# EAGLE design NIRGM V3 E7 (EAGLE 7.7.0)

## Sheet 1 of 7: Voltage Regulator
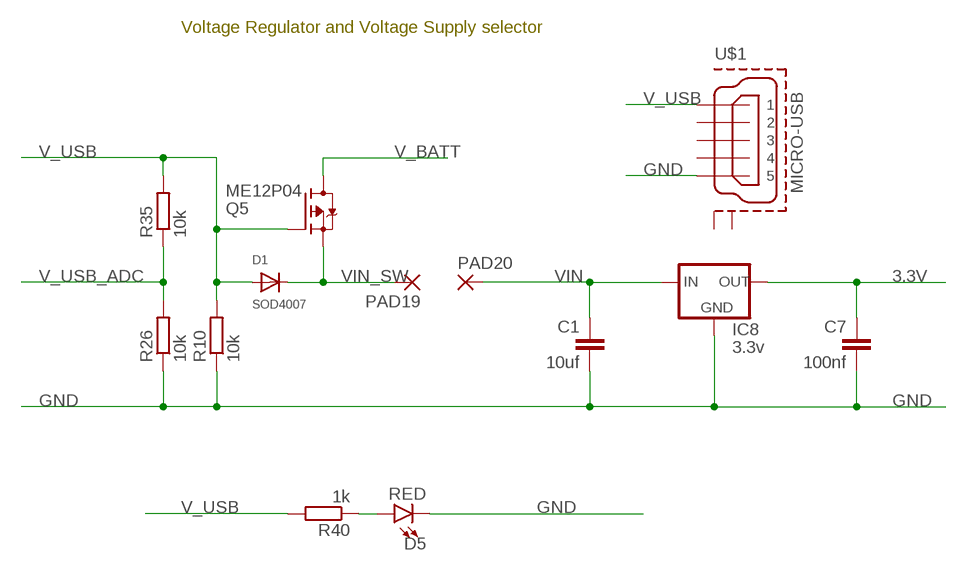
[diagram p0: schematic, sheet 1]

### Parts
C1  10uf  C-EUC1206K  [C1206K]
C7  100nf  C-EUC1206K  [C1206K]
D1  SOD4007  DIODE_SOD-123FL  [SOD-123FL]
D5  RED  LED-GREEN1206  [LED-1206]
IC8  3.3v  LM1117TO252  [TO252]
PAD19  SMD2  [SMD1,27-2,54]
PAD20  SMD2  [SMD1,27-2,54]
Q5  ME12P04  FDD4141TO252  [TO252]
R10  10k  R-EU_R1206  [R1206]
R26  10k  R-EU_R1206  [R1206]
R35  10k  R-EU_R1206  [R1206]
R40  1k  R-EU_R1206  [R1206]
U$1  MICRO-USB  MICRO-USB-RECEPTACLE47589-0001  [47589-0001]

### Nets
3.3V: C7.1 IC8.3(OUT) ; also sheet 3,4,5,6,7
GND: C1.2 C7.2 D5.C IC8.1(GND) R10.1 R26.1 U$1.5 ; also sheet 2,3,4,5,6,7
N$1: D5.A R40.1
V_BATT: Q5.3(D) ; also sheet 2,7
V_USB: D1.A Q5.1(G) R10.2 R35.2 R40.2 U$1.1 ; also sheet 2
V_USB_ADC: R26.2 R35.1 ; also sheet 5
VIN: C1.1 IC8.2(IN) PAD20.1(P)
VIN_SW: D1.C PAD19.1(P) Q5.2(S)
Unconnected: U$1.2 U$1.3 U$1.4 U$1.P$1(GND1) U$1.P$2(GND2)

### Notes on the sheet
- Voltage Regulator and Voltage Supply selector

## Sheet 2 of 7: Lithium-Polymer Battery Charger (1-cell)
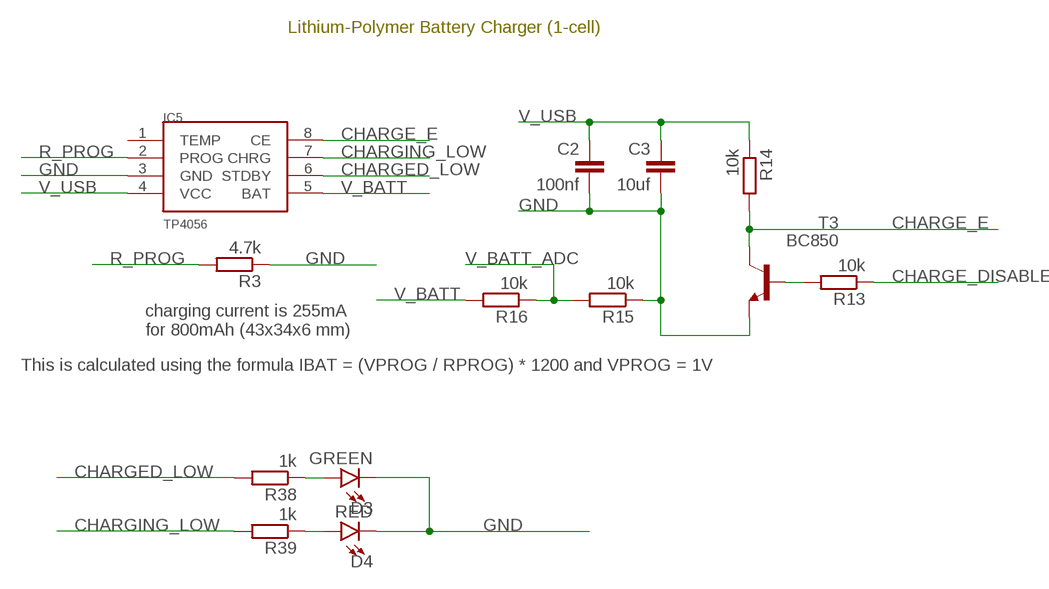
[diagram p1: schematic, sheet 2]

### Parts
C2  100nf  C-EUC1206K  [C1206K]
C3  10uf  C-EUC1206K  [C1206K]
D3  GREEN  LED-GREEN1206  [LED-1206]
D4  RED  LED-GREEN1206  [LED-1206]
IC5  TP4056  [SOP-8]
R3  4.7k  R-EU_R1206  [R1206]
R13  10k  R-EU_R1206  [R1206]
R14  10k  R-EU_R1206  [R1206]
R15  10k  R-EU_R1206  [R1206]
R16  10k  R-EU_R1206  [R1206]
R38  1k  R-EU_R1206  [R1206]
R39  1k  R-EU_R1206  [R1206]
T3  BC850  [SOT23]

### Nets
CHARGE_DISABLE: R13.1 ; also sheet 5
CHARGE_E: IC5.8(CE) R14.2 T3.3(C)
CHARGED_LOW: IC5.6(STDBY) R38.2 ; also sheet 5
CHARGING_LOW: IC5.7(CHRG) R39.2 ; also sheet 5
GND: C2.2 C3.2 D3.C D4.C IC5.3(GND) R3.1 R15.1 T3.2(E) ; also sheet 1,3,4,5,6,7
N$4: D3.A R38.1
N$6: D4.A R39.1
N$13: R13.2 T3.1(B)
R_PROG: IC5.2(PROG) R3.2
V_BATT: IC5.5(BAT) R16.2 ; also sheet 1,7
V_BATT_ADC: R15.2 R16.1 ; also sheet 5
V_USB: C2.1 C3.1 IC5.4(VCC) R14.1 ; also sheet 1
Unconnected: IC5.1(TEMP)

### Notes on the sheet
- Lithium-Polymer Battery Charger (1-cell)
- charging current is 255mA
  for 800mAh (43x34x6 mm)
- This is calculated using the formula IBAT = (VPROG / RPROG) * 1200 and VPROG = 1V

## Sheet 3 of 7: Negative Voltage Generator
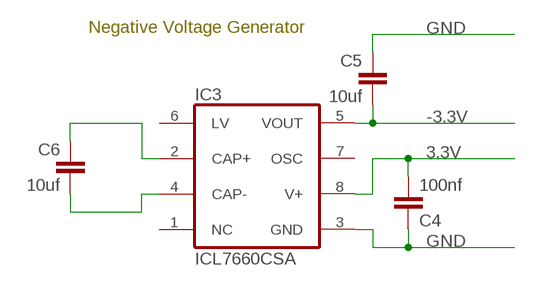
[diagram p2: schematic, sheet 3]

### Parts
C4  100nf  C-EUC1206K  [C1206K]
C5  10uf  C-EUC1206K  [C1206K]
C6  10uf  C-EUC1206K  [C1206K]
IC3  ICL7660CSA  [SO08]

### Nets
3.3V: C4.2 IC3.8(V+) ; also sheet 1,4,5,6,7
-3.3V: C5.2 IC3.5(VOUT) ; also sheet 6
GND: C4.1 C5.1 IC3.3(GND) ; also sheet 1,2,4,5,6,7
N$10: C6.1 IC3.2(CAP+)
N$16: C6.2 IC3.4(CAP-)
Unconnected: IC3.1(NC) IC3.6(LV) IC3.7(OSC)

### Notes on the sheet
- Negative Voltage Generator

## Sheet 4 of 7: LED Driver
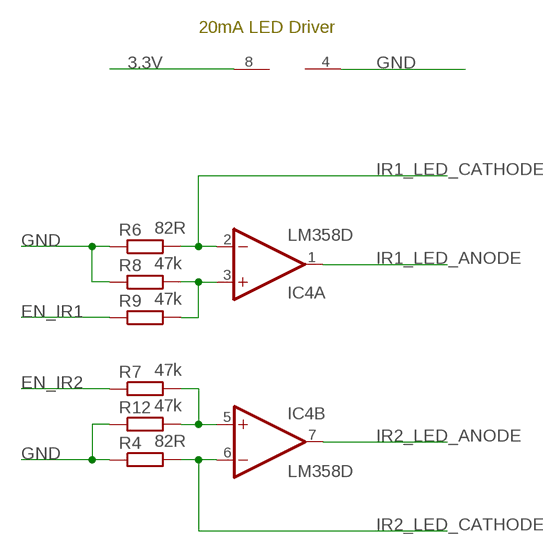
[diagram p3: schematic, sheet 4]

### Parts
IC4  LM358D  [SO08]
R4  82R  R-EU_R1206  [R1206]
R6  82R  R-EU_R1206  [R1206]
R7  47k  R-EU_R1206  [R1206]
R8  47k  R-EU_R1206  [R1206]
R9  47k  R-EU_R1206  [R1206]
R12  47k  R-EU_R1206  [R1206]

### Nets
3.3V: IC4.8(P:V+) ; also sheet 1,3,5,6,7
EN_IR1: R9.1 ; also sheet 5
EN_IR2: R7.1 ; also sheet 5
GND: IC4.4(P:V-) R4.1 R6.1 R8.1 R12.1 ; also sheet 1,2,3,5,6,7
IR1_LED_ANODE: IC4.1(A:OUT) ; also sheet 7
IR1_LED_CATHODE: IC4.2(A:-IN) R6.2 ; also sheet 7
IR2_LED_ANODE: IC4.7(B:OUT) ; also sheet 7
IR2_LED_CATHODE: IC4.6(B:-IN) R4.2 ; also sheet 7
N$30: IC4.3(A:+IN) R8.2 R9.2
N$31: IC4.5(B:+IN) R7.2 R12.2

### Notes on the sheet
- 20mA LED Driver

## Sheet 5 of 7: ESP32
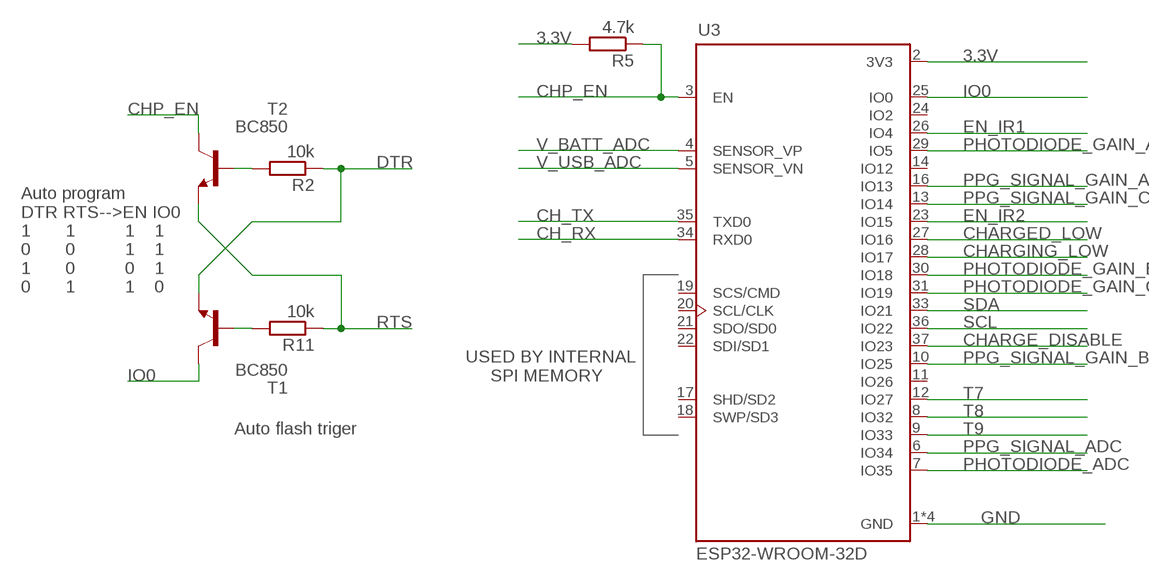
[diagram p4: schematic, sheet 5]

### Parts
R2  10k  R-EU_R1206  [R1206]
R5  4.7k  R-EU_R1206  [R1206]
R11  10k  R-EU_R1206  [R1206]
T1  BC850  [SOT23]
T2  BC850  [SOT23]
U3  ESP32-WROOM-32D  [MODULE_ESP32-WROOM-32D]

### Nets
3.3V: R5.2 U3.2(3V3) ; also sheet 1,3,4,6,7
CH_RX: U3.34(RXD0) ; also sheet 7
CH_TX: U3.35(TXD0) ; also sheet 7
CHARGE_DISABLE: U3.37(IO23) ; also sheet 2
CHARGED_LOW: U3.27(IO16) ; also sheet 2
CHARGING_LOW: U3.28(IO17) ; also sheet 2
CHP_EN: R5.1 T2.3(C) U3.3(EN)
DTR: R2.1 T1.2(E) ; also sheet 7
EN_IR1: U3.26(IO4) ; also sheet 4
EN_IR2: U3.23(IO15) ; also sheet 4
GND: U3.1(GND) U3.15(GND) U3.38(GND) U3.39(GND) ; also sheet 1,2,3,4,6,7
IO0: T1.3(C) U3.25(IO0)
N$5: R11.2 T1.1(B)
N$18: R2.2 T2.1(B)
PHOTODIODE_ADC: U3.7(IO35) ; also sheet 6
PHOTODIODE_GAIN_A: U3.29(IO5) ; also sheet 6
PHOTODIODE_GAIN_B: U3.30(IO18) ; also sheet 6
PHOTODIODE_GAIN_C: U3.31(IO19) ; also sheet 6
PPG_SIGNAL_ADC: U3.6(IO34) ; also sheet 6
PPG_SIGNAL_GAIN_A: U3.16(IO13) ; also sheet 6
PPG_SIGNAL_GAIN_B: U3.10(IO25) ; also sheet 6
PPG_SIGNAL_GAIN_C: U3.13(IO14) ; also sheet 6
RTS: R11.1 T2.2(E) ; also sheet 7
SCL: U3.36(IO22) ; also sheet 7
SDA: U3.33(IO21) ; also sheet 7
T7: U3.12(IO27) ; also sheet 7
T8: U3.8(IO32) ; also sheet 7
T9: U3.9(IO33) ; also sheet 7
V_BATT_ADC: U3.4(SENSOR_VP) ; also sheet 2
V_USB_ADC: U3.5(SENSOR_VN) ; also sheet 1
Unconnected: U3.11(IO26) U3.14(IO12) U3.17(SHD/SD2) U3.18(SWP/SD3) U3.19(SCS/CMD) U3.20(SCL/CLK) U3.21(SDO/SD0) U3.22(SDI/SD1) U3.24(IO2)

### Notes on the sheet
- Auto program
  DTR RTS-->EN IO0 
  1       1          1    1
  0       0          1    1
  1       0          0    1
  0       1          1    0
- USED BY INTERNAL
       SPI MEMORY
- Auto flash triger

## Sheet 6 of 7: Programable gain amplifier
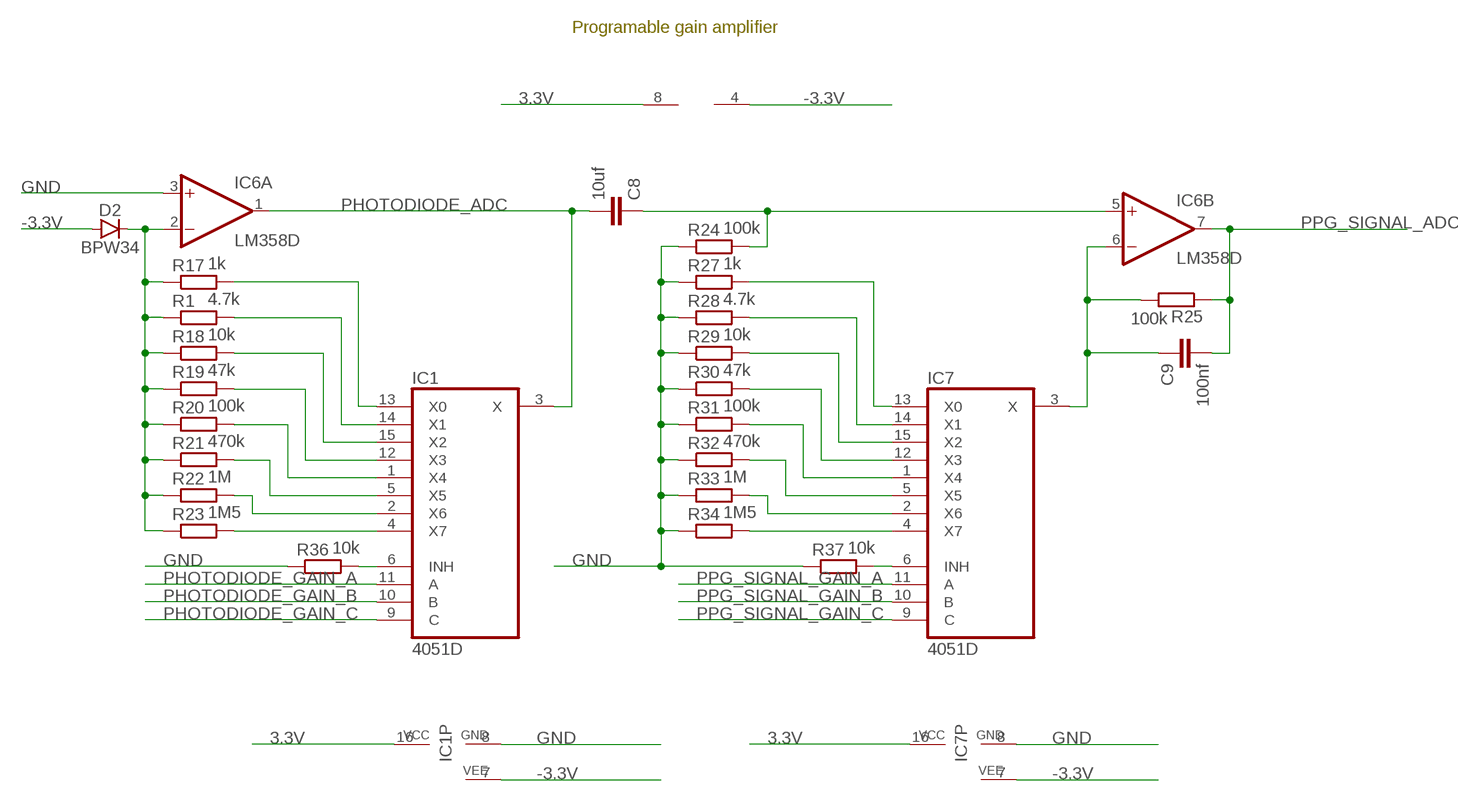
[diagram p5: schematic, sheet 6]

### Parts
C8  10uf  C-EUC1206K  [C1206K]
C9  100nf  C-EUC1206K  [C1206K]
D2  BPW34  [BPW34]
IC1  4051D  [SO16]
IC6  LM358D  [SO08]
IC7  4051D  [SO16]
R1  4.7k  R-EU_R1206  [R1206]
R17  1k  R-EU_R1206  [R1206]
R18  10k  R-EU_R1206  [R1206]
R19  47k  R-EU_R1206  [R1206]
R20  100k  R-EU_R1206  [R1206]
R21  470k  R-EU_R1206  [R1206]
R22  1M  R-EU_R1206  [R1206]
R23  1M5  R-EU_R1206  [R1206]
R24  100k  R-EU_R1206  [R1206]
R25  100k  R-EU_R1206  [R1206]
R27  1k  R-EU_R1206  [R1206]
R28  4.7k  R-EU_R1206  [R1206]
R29  10k  R-EU_R1206  [R1206]
R30  47k  R-EU_R1206  [R1206]
R31  100k  R-EU_R1206  [R1206]
R32  470k  R-EU_R1206  [R1206]
R33  1M  R-EU_R1206  [R1206]
R34  1M5  R-EU_R1206  [R1206]
R36  10k  R-EU_R1206  [R1206]
R37  10k  R-EU_R1206  [R1206]

### Nets
3.3V: IC1.16(VCC) IC6.8(P:V+) IC7.16(VCC) ; also sheet 1,3,4,5,7
-3.3V: D2.P$1(A) IC1.7(VEE) IC6.4(P:V-) IC7.7(VEE) ; also sheet 3
GND: IC1.8(GND) IC6.3(A:+IN) IC7.8(GND) R24.1 R27.1 R28.1 R29.1 R30.1 R31.1 R32.1 R33.1 R34.1 R36.1 R37.1 ; also sheet 1,2,3,4,5,7
N$3: IC1.6(INH) R36.2
N$11: IC7.6(INH) R37.2
N$14: IC1.13(X0) R17.2
N$19: IC1.14(X1) R1.2
N$20: D2.P$2(C) IC6.2(A:-IN) R1.1 R17.1 R18.1 R19.1 R20.1 R21.1 R22.1 R23.1
N$29: C8.1 IC6.5(B:+IN) R24.2
N$32: IC1.15(X2) R18.2
N$33: IC1.12(X3) R19.2
N$34: IC1.1(X4) R20.2
N$35: IC1.5(X5) R21.2
N$36: IC1.2(X6) R22.2
N$37: IC1.4(X7) R23.2
N$39: C9.1 IC6.6(B:-IN) IC7.3(X) R25.2
N$40: IC7.13(X0) R27.2
N$41: IC7.14(X1) R28.2
N$42: IC7.15(X2) R29.2
N$43: IC7.12(X3) R30.2
N$44: IC7.1(X4) R31.2
N$45: IC7.5(X5) R32.2
N$46: IC7.2(X6) R33.2
N$47: IC7.4(X7) R34.2
PHOTODIODE_ADC: C8.2 IC1.3(X) IC6.1(A:OUT) ; also sheet 5
PHOTODIODE_GAIN_A: IC1.11(A) ; also sheet 5
PHOTODIODE_GAIN_B: IC1.10(B) ; also sheet 5
PHOTODIODE_GAIN_C: IC1.9(C) ; also sheet 5
PPG_SIGNAL_ADC: C9.2 IC6.7(B:OUT) R25.1 ; also sheet 5
PPG_SIGNAL_GAIN_A: IC7.11(A) ; also sheet 5
PPG_SIGNAL_GAIN_B: IC7.10(B) ; also sheet 5
PPG_SIGNAL_GAIN_C: IC7.9(C) ; also sheet 5

### Notes on the sheet
- Programable gain amplifier

## Sheet 7 of 7: OLED LCD and Connectors
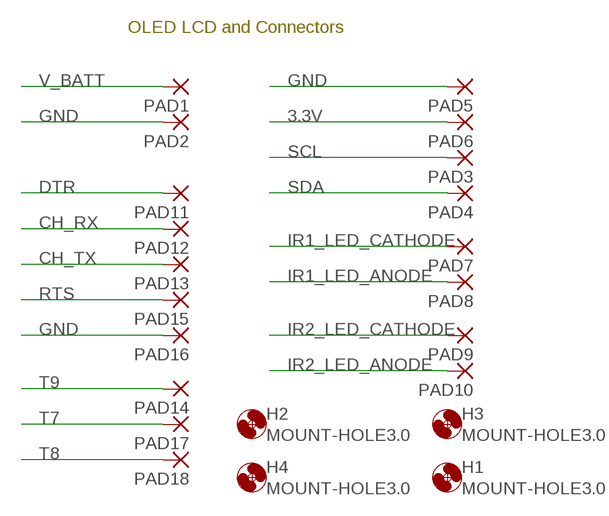
[diagram p6: schematic, sheet 7]

### Parts
H1  MOUNT-HOLE3.0  [3,0]
H2  MOUNT-HOLE3.0  [3,0]
H3  MOUNT-HOLE3.0  [3,0]
H4  MOUNT-HOLE3.0  [3,0]
PAD1  WIREPADSMD5-2,5  [5-2,5]
PAD2  WIREPADSMD5-2,5  [5-2,5]
PAD3  SMD2  [SMD1,27-2,54]
PAD4  SMD2  [SMD1,27-2,54]
PAD5  SMD2  [SMD1,27-2,54]
PAD6  SMD2  [SMD1,27-2,54]
PAD7  SMD2  [SMD1,27-2,54]
PAD8  SMD2  [SMD1,27-2,54]
PAD9  SMD2  [SMD1,27-2,54]
PAD10  SMD2  [SMD1,27-2,54]
PAD11  SMD2  [SMD1,27-2,54]
PAD12  SMD2  [SMD1,27-2,54]
PAD13  SMD2  [SMD1,27-2,54]
PAD14  SMD2  [SMD1,27-2,54]
PAD15  SMD2  [SMD1,27-2,54]
PAD16  SMD2  [SMD1,27-2,54]
PAD17  SMD2  [SMD1,27-2,54]
PAD18  SMD2  [SMD1,27-2,54]

### Nets
3.3V: PAD6.1(P) ; also sheet 1,3,4,5,6
CH_RX: PAD12.1(P) ; also sheet 5
CH_TX: PAD13.1(P) ; also sheet 5
DTR: PAD11.1(P) ; also sheet 5
GND: PAD2.1(P) PAD5.1(P) PAD16.1(P) ; also sheet 1,2,3,4,5,6
IR1_LED_ANODE: PAD8.1(P) ; also sheet 4
IR1_LED_CATHODE: PAD7.1(P) ; also sheet 4
IR2_LED_ANODE: PAD10.1(P) ; also sheet 4
IR2_LED_CATHODE: PAD9.1(P) ; also sheet 4
RTS: PAD15.1(P) ; also sheet 5
SCL: PAD3.1(P) ; also sheet 5
SDA: PAD4.1(P) ; also sheet 5
T7: PAD17.1(P) ; also sheet 5
T8: PAD18.1(P) ; also sheet 5
T9: PAD14.1(P) ; also sheet 5
V_BATT: PAD1.1(P) ; also sheet 1,2

### Notes on the sheet
- OLED LCD and Connectors

## Library data of the parts
C1-C9 = rcl:C-EU: CAPACITOR, European symbol; SPICEPREFIX: C
D1 = adafruit:DIODE: Diode SMADIODE - SMA Surface Mount Package 20V 1A Schottky Diode Digikey: 641-1014-6-ND DO-1N4148 - Through Hole Small Current Diode SOD-123 20V 1 A (.5mV Vf) Schottky Diode - Digikey: MBRX120TPMSCT-ND SOD-323 10V 570mA (.38mV Vf, 3ns) Schottky Diode - Digikey: ZLLS410CT-ND SOD-523 30V 30mA Schottky Diode (RB751S-40TE61) - Digikey: RB751S-40TE61CT-ND SOT23-R/W - SOT23 Package (R = Solder Paste/Reflow Ovens, W = Hand-Soldering) BAT54Film 40V 300mA - Digikey: 497-7162-1-ND
D2 = SparkFun-Sensors:BPW34: Vishay BPW34 Silicon PIN Photodiode (Miniature Solar Cell) BPW34 is a PIN photodiode with high speed and high radiant sensitivity in miniature, flat, top view, clear plastic package. It is sensitive to visible and near infrared radiation. BPW34S is packed in tubes, specifications like BPW34. Datasheet: https://www.sparkfun.com/datasheets/Prototyping/Solar/bpw34.pdf SparkFun Products Miniature Solar Cell - BPW34 <https://www.sparkfun.com/products/9541> (PRT-09541); SF_ID: PRT-09541
D3 = SparkFun-LED:LED-GREEN: Green SMD LED Used in manufacturing of various products at SparkFun Packages: 0603 - SMD 0603 package [Product Link] <http://www.futureelectronics.com/en/technologies/semiconductors/optoelectronics/leds/Pages/9894312-LTST-C190GKT.aspx?CrossPart=HSMG-C190&IM=0> LilyPad 1206 - SMD1206 LilyPad package [Product Link] <http://www.futureelectronics.com/en/Technologies/Product.aspx?ProductID=IN150NGHARVATEKCORPORATION2049943&IM=0> 1206 - SMD1206 package [Product Link] <http://www.futureelectronics.com/en/technologies/semiconductors/optoelectronics/leds/Pages/8315665-LTST-C150KGKT.aspx?IM=0> 1206 Bottom Mount -SMD 1206 Bottom Mount [Product Link] <http://www.digikey.com/product-detail/en/lite-on-inc/LTST-C230KGKT/160-1456-1-ND/386854> SparkFun Products: Pro Mini 328 -5V <https://www.sparkfun.com/products/821> RedBoard <https://www.sparkfun.com/products/12757> MP3 Trigger <https://www.sparkfun.com/products/13720> Makey Makey <https://www.sparkfun.com/products/11076>; PROD_ID: DIO-00862
D4 D5 = SparkFun-LED:LED-GREEN: Green SMD LED Used in manufacturing of various products at SparkFun Packages: 0603 - SMD 0603 package [Product Link] <http://www.futureelectronics.com/en/technologies/semiconductors/optoelectronics/leds/Pages/9894312-LTST-C190GKT.aspx?CrossPart=HSMG-C190&IM=0> LilyPad 1206 - SMD1206 LilyPad package [Product Link] <http://www.futureelectronics.com/en/Technologies/Product.aspx?ProductID=IN150NGHARVATEKCORPORATION2049943&IM=0> 1206 - SMD1206 package [Product Link] <http://www.futureelectronics.com/en/technologies/semiconductors/optoelectronics/leds/Pages/8315665-LTST-C150KGKT.aspx?IM=0> 1206 Bottom Mount -SMD 1206 Bottom Mount [Product Link] <http://www.digikey.com/product-detail/en/lite-on-inc/LTST-C230KGKT/160-1456-1-ND/386854> SparkFun Products: Pro Mini 328 -5V <https://www.sparkfun.com/products/821> RedBoard <https://www.sparkfun.com/products/12757> MP3 Trigger <https://www.sparkfun.com/products/13720> Makey Makey <https://www.sparkfun.com/products/11076>; PROD_ID: DIO-00862; VALUE: GREEN
H1-H4 = holes:MOUNT-HOLE: MOUNTING HOLE with drill center marker
IC1 IC7 = 40xx:4051: 8-channel ANALOG MULTIPLEXER
IC3 = maxim:ICL7660CSA: VOLTAGE CONVERTER; MF: MAXIM; MPN: ICL7660CSA; OC_FARNELL: 9724710; OC_NEWARK: 34C3732
IC4 = linear:LM358: OP AMP also LM158; LM258; LM2904 Source: http://cache.national.com/ds/LM/LM158.pdf
IC5 = TP4056:TP4056
IC6 = linear@1:LM358: OP AMP also LM158; LM258; LM2904 Source: http://cache.national.com/ds/LM/LM158.pdf
IC8 = v-reg-2:LM1117
PAD1 PAD2 = wirepad:WIREPAD: Wire PAD connect wire on PCB
PAD3-PAD20 = wirepad@1:SMD2: SMD PAD
Q5 = transistor-fet:FDD4141: P-Channel PowerTrench® MOSFET Source: FDD4141.pdf
R1-R40 = rcl:R-EU_: RESISTOR, European symbol; SPICEPREFIX: R
T1-T3 = transistor:BC850: NPN TRANSISTOR
U3 = ESP32-WROOM-32DMODED:ESP32-WROOM-32D: IC: SoC; GPIO, I2C, I2S, IR, SD, SDIO, SPI, UART; 2.7÷3.6VDC; 20dBm; AVAILABILITY: Unavailable; DESCRIPTION: IC: SoC; GPIO, I2C, I2S, IR, SD, SDIO, SPI, UART; 2.7÷3.6VDC; 20dBm; MF: Espressif Systems; MP: ESP32-WROOM-32D; PACKAGE: Module Espressif Systems; PRICE: None
U$1 = con-molex-usb:MICRO-USB-RECEPTACLE: MICRO USB RECEPTACLES Micro-USB Receptacles, SMT, Lead-Free from MOLEX <http://www.molex.com/>. (C) 2014 Tomasz Boleslaw CEDRO, cederom@tlen.pl, http://www.tomek.cedro.info. Version 0.1 (2014-01-17): Initial release. Version 0.2 (2014-02-06): Updated 47589-0001 footprint pins/pads/milling. Following devices are included: 1. 47589-0001 Micro-USB AB Receptacle, Bottom Mount, SMT, Lead-Free <http://www.molex.com/molex/products/datasheet.jsp?part=active/0475890001_IO_CONNECTORS.xml> (Technical Drawing <http://www.molex.com/pdm_docs/sd/475890001_sd.pdf>).

## Board
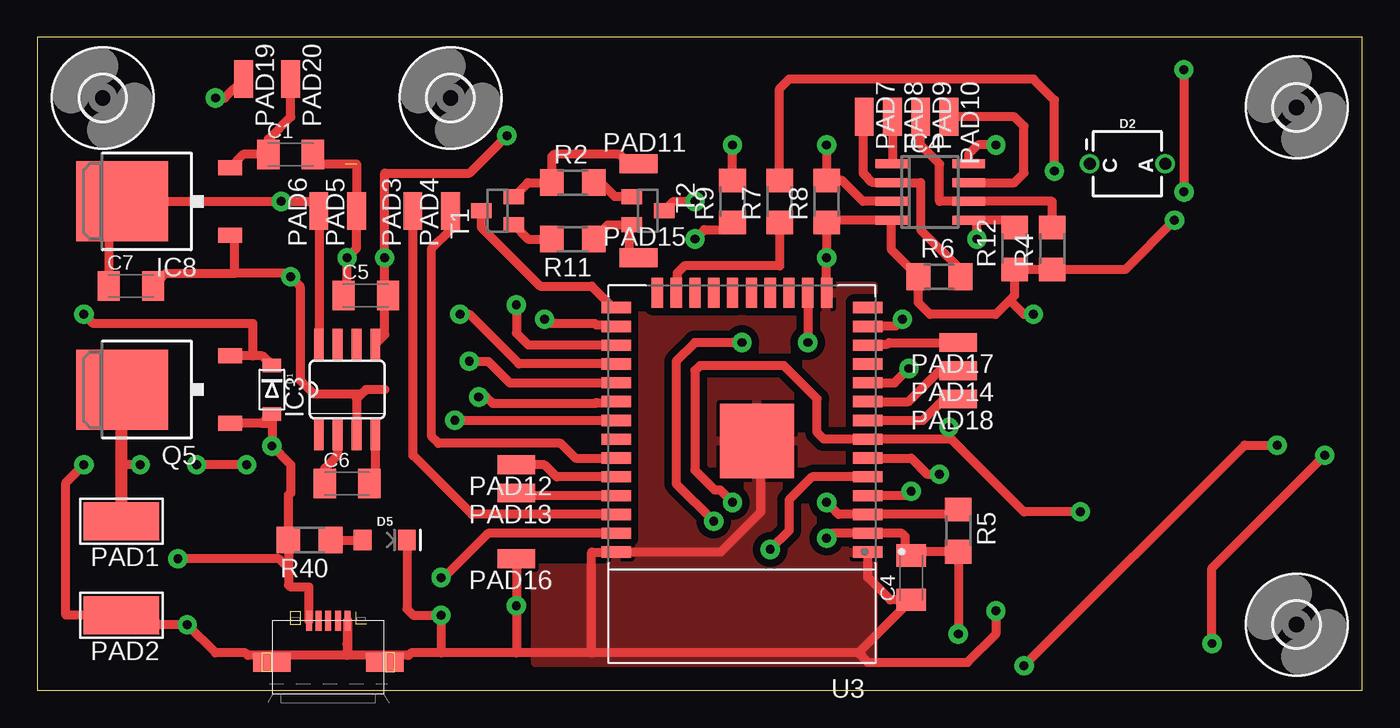
[diagram p7: board, top side]
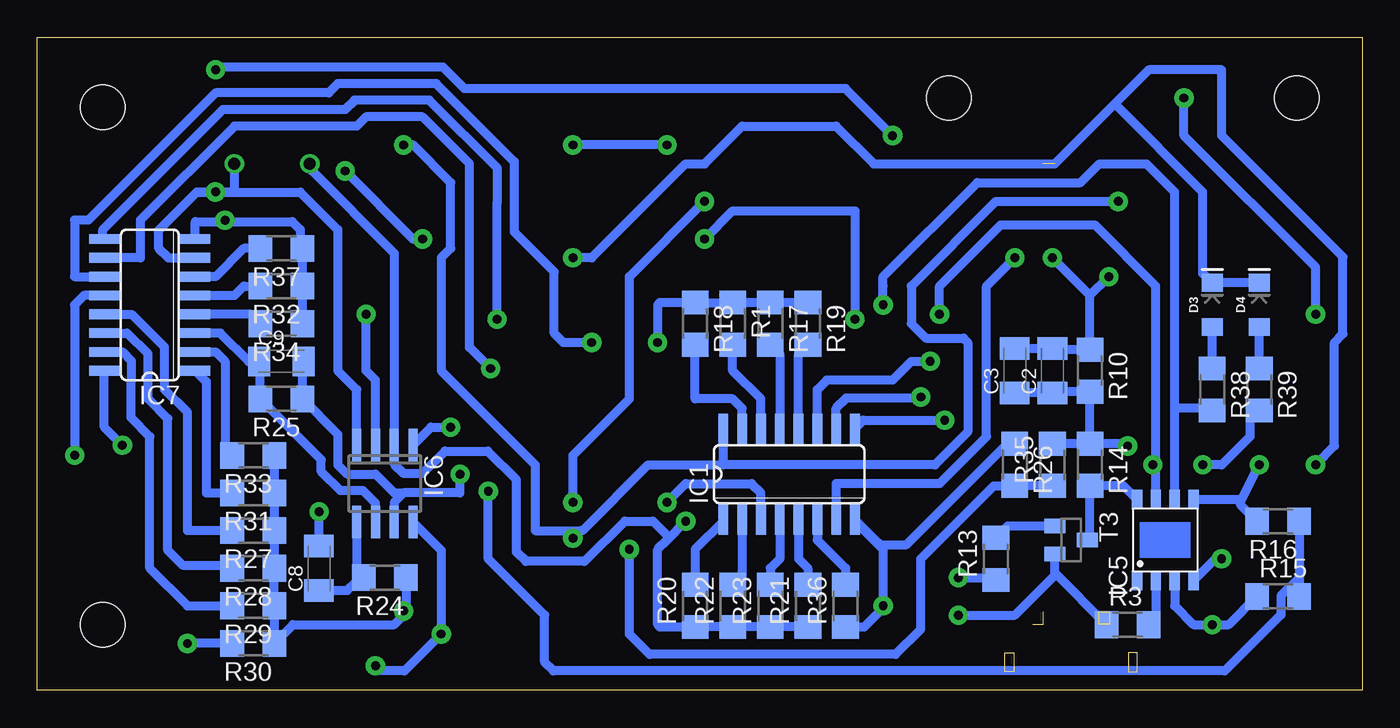
[diagram p8: board, bottom side, seen from below]

Size 89.52 x 44.12 mm. Coordinates in mm from the lower left corner, seen from the top.
Outline: 89.52,0 89.52,44.12 0,44.12 0,0 89.52,0
Copper layers (1*16): Top 0.035mm / dielectric 1.5mm / Bottom 0.035mm
Design rules "default *": minimum track width 6mil, minimum drill 0.35mm, track to track 20mil, track to pad 20mil, pad to pad 6mil, via to via 6mil, smd to smd 6mil, copper to edge 40mil, drill to drill 6mil, minimum pad ring 10mil, minimum via ring 8mil, stop-mask expansion 4mil, vias tented up to drill 0mil, thermal gap 10mil

### Footprints (pad centres in the part's own frame; a part is rotated, then mirrored left to right if it is on the bottom)
C1206K = smd 1.5 x 2: 1 -1.5,0; 2 1.5,0
SOD-123FL = smd 0.91 x 1.22: A 1.637,0; C -1.637,0
BPW34 = drill 0.8: P$1 0,2.55; P$2 0,-2.55
LED-1206 = smd 1.2 x 1.4: A -1.5,0; C 1.5,0
3,0 = hole 3: 0,0
SO16 = smd 0.66 x 2.032: 1 -4.445,-3.073; 2 -3.175,-3.073; 3 -1.905,-3.073; 4 -0.635,-3.073; 5 0.635,-3.073; 6 1.905,-3.073; 7 3.175,-3.073; 8 4.445,-3.073; 9 4.445,3.073; 10 3.175,3.073; 11 1.905,3.073; 12 0.635,3.073; 13 -0.635,3.073; 14 -1.905,3.073; 15 -3.175,3.073; 16 -4.445,3.073
SO08 = smd 0.66 x 2.032: 1 -1.905,-3.073; 2 -0.635,-3.073; 3 0.635,-3.073; 4 1.905,-3.073; 5 1.905,3.073; 6 0.635,3.073; 7 -0.635,3.073; 8 -1.905,3.073
SO08' = smd 0.6 x 2.2: 1 -1.905,-2.6; 2 -0.635,-2.6; 3 0.635,-2.6; 4 1.905,-2.6; 5 1.905,2.6; 6 0.635,2.6; 7 -0.635,2.6; 8 -1.905,2.6
SOP-8 = smd 1.3 x 0.7: 1 -2.75,1.905; 2 -2.75,0.635; 3 -2.75,-0.635; 4 -2.75,-1.905; 5 2.75,-1.905; 6 2.75,-0.635; 7 2.75,0.635; 8 2.75,1.905
TO252 = smd 1 x 1.6: 1 -2.28,-6.07; 2 2.28,-6.07 | smd 5.4 x 6.2: 3 0,1.23
5-2,5 = smd 2.54 x 5.08: 1 0,0
SMD1,27-2,54 = smd 1.27 x 2.54: 1 0,0
TO252' = smd 1 x 1.6: 1 -2.28,-4.8; 2 2.28,-4.8 | smd 5.4 x 6.2: 3 0,2.5
R1206 = smd 1.6 x 1.803: 1 -1.422,0; 2 1.422,0
SOT23 = smd 1 x 1.4: 1 -0.95,-1.1; 2 0.95,-1.1; 3 0,1.1
MODULE_ESP32-WROOM-32D = smd 2 x 0.762: 1 -8.5,5.26; 2 -8.5,3.99; 3 -8.5,2.72; 4 -8.5,1.45; 5 -8.5,0.18; 6 -8.5,-1.09; 7 -8.5,-2.36; 8 -8.5,-3.63; 9 -8.5,-4.9; 10 -8.5,-6.17; 11 -8.5,-7.44; 12 -8.5,-8.71; 13 -8.5,-9.98; 14 -8.5,-11.25; 25 8.5,-11.25; 26 8.5,-9.98; 27 8.5,-8.71; 28 8.5,-7.44; 29 8.5,-6.17; 30 8.5,-4.9; 31 8.5,-3.63; 32 8.5,-2.36; 33 8.5,-1.09; 34 8.5,0.18; 35 8.5,1.45; 36 8.5,2.72; 37 8.5,3.99; 38 8.5,5.26 | smd 0.762 x 2: 15 -5.715,-12.25; 16 -4.445,-12.25; 17 -3.175,-12.25; 18 -1.905,-12.25; 19 -0.635,-12.25; 20 0.635,-12.25; 21 1.905,-12.25; 22 3.175,-12.25; 23 4.445,-12.25; 24 5.715,-12.25 | smd 5 x 5: 39 -1,-2.24
47589-0001 = smd 1.35 x 0.4: 1 2.8,1.3; 2 2.8,0.65; 3 2.8,0; 4 2.8,-0.65; 5 2.8,-1.3 | smd 1.27 x 2.54: P$1 0,3.81; P$2 0,-3.81

### Placement (x,y rotation side)
C1  17.13,36.2 0 top
C2  20.94,21.59 90 bottom
C3  23.48,21.59 90 bottom
C4  59.05,7.62 90 top
C5  22.21,26.67 0 top
C6  20.94,13.97 0 top
C7  6.34,27.3 0 top
C8  70.47,8.26 90 bottom
C9  73.02,22.23 0 bottom
D1  15.87,20.32 270 top
D2  73.65,35.56 270 top
D3  10.15,26.04 90 bottom
D4  6.98,26.04 90 bottom
D5  23.48,10.16 0 top
H1  4.44,40.01 90 top
H2  27.93,40.01 90 top
H3  85.08,4.45 90 top
H4  85.08,39.37 90 top
IC1  38.73,14.61 0 bottom
IC3  20.94,20.32 0 top
IC4  LM358D  [SO08']  60.32,33.66 270 top
IC5  13.33,10.16 90 bottom
IC6  LM358D  [SO08']  66.03,13.97 180 bottom
IC7  81.91,26.04 90 bottom
IC8  6.98,33.02 90 top
PAD1  5.71,11.43 90 top
PAD2  5.71,5.08 90 top
PAD3  25.39,32.38 0 top
PAD4  27.93,32.38 0 top
PAD5  21.58,32.38 0 top
PAD6  19.04,32.38 0 top
PAD7  55.87,38.73 180 top
PAD8  57.77,38.73 180 top
PAD9  59.68,38.73 180 top
PAD10  61.59,38.73 180 top
PAD11  40.63,35.56 270 top
PAD12  32.38,15.24 90 top
PAD13  32.38,13.34 90 top
PAD14  62.22,21.59 90 top
PAD15  40.63,29.21 270 top
PAD16  32.38,8.89 90 top
PAD17  62.22,23.5 90 top
PAD18  62.22,19.68 90 top
PAD19  13.96,41.27 180 top
PAD20  17.13,41.27 180 top
Q5  ME12P04  [TO252']  8.25,20.32 90 top
R1  42.54,24.77 270 bottom
R2  36.19,34.29 0 top
R3  15.87,4.45 0 bottom
R4  68.57,29.84 90 top
R5  62.22,10.79 270 top
R6  60.95,27.94 0 top
R7  50.16,33.02 90 top
R8  53.33,33.02 90 top
R9  46.98,33.02 90 top
R10  18.4,21.59 270 bottom
R11  36.19,30.48 180 top
R12  66.03,29.84 90 top
R13  24.75,8.89 90 bottom
R14  18.4,15.24 270 bottom
R15  5.71,6.35 0 bottom
R16  5.71,11.43 180 bottom
R17  40,24.77 270 bottom
R18  45.08,24.77 270 bottom
R19  37.46,24.77 270 bottom
R20  45.08,5.71 90 bottom
R21  37.46,5.71 90 bottom
R22  42.54,5.71 90 bottom
R23  40,5.71 90 bottom
R24  66.03,7.62 180 bottom
R25  73.02,19.68 180 bottom
R26  23.48,15.24 270 bottom
R27  74.92,10.79 180 bottom
R28  74.92,8.26 180 bottom
R29  74.92,5.71 180 bottom
R30  74.92,3.17 180 bottom
R31  74.92,13.34 180 bottom
R32  73.02,27.3 180 bottom
R33  74.92,15.88 180 bottom
R34  73.02,24.77 180 bottom
R35  20.94,15.24 90 bottom
R36  34.91,5.71 90 bottom
R37  73.02,29.84 180 bottom
R38  10.15,20.32 270 bottom
R39  6.98,20.32 270 bottom
R40  18.4,10.16 180 top
T1  31.1,32.38 90 top
T2  41.27,32.38 270 top
T3  19.67,10.16 270 bottom
U3  47.62,14.61 180 top
U$1  19.67,1.91 90 top

### Tracks (layer width: path | path; a pad name or v marks a point on that pad's centre or on a via)
3.3V  (via drill 0.6 pad 1.3)
  Top 0.61: IC3.8 PAD6.1 18.4,33.02 v16.5,33.02 IC8.3 4.84,32.12 C7.1 | IC4.8 62.91,36.2 63.55,36.83 v64.76,36.83 | v62.22,3.81 R5.2 59.3,9.37 C4.2 58.64,9.53 58.64,10.39 58.41,10.62 U3.2 53.67,10.62 v53.33,10.27 | v66.66,1.67 81.56,16.56 v83.76,16.56
  Bottom 0.61: v16.5,33.02 24.75,33.02 30.47,27.3 30.47,24.77 29.49,23.79 26.95,23.79 26.66,23.5 26.66,17.46 28.88,15.24 43.17,15.24 | 43.17,15.24 IC1.16 | v64.76,36.83 64.12,36.83 61.59,34.29 61.59,29.84 62.22,29.21 62.22,21.59 55.87,15.24 55.87,10.79 52.81,10.79 | IC6.8 62.22,9.46 v62.22,3.81 64.71,1.32 66.66,1.32 v66.66,1.67 | 52.81,10.79 52.7,10.79 48.25,15.24 43.17,15.24 | 52.81,10.79 v53.33,10.27 | IC7.16 84.98,17.78 v83.76,16.56
-3.3V  (via drill 0.6 pad 1.3)
  Top 0.61: IC3.5 23.48,24.03 23.48,26.44 | 23.48,26.44 23.48,26.67 | 23.48,26.67 v23.48,29.21 23.48,34.92 29.2,34.92 v31.74,37.47 | 23.48,26.67 C5.2 23.48,26.44 | v77.46,41.91 v77.47,41.9 v77.47,33.66
  Bottom 0.61: v23.48,29.21 25.39,27.3 25.39,17.14 28.56,13.97 35.55,13.97 IC1.7 | IC6.4 67.93,20.32 69.2,21.59 69.2,31.11 71.74,33.66 76.82,33.66 | 78.73,33.66 76.82,33.66 | IC7.7 80.63,29.21 81.33,29.91 81.33,31.05 78.73,33.66 | v77.47,33.66 78.73,33.66 | D2.P$1 76.2,33.66 76.82,33.66 | v77.46,41.91 77.28,42.09 62.1,42.09 60.65,40.64 34.91,40.64 v31.74,37.47
CH_RX
  Top 0.61: U3.34 35.09,14.43 34.28,15.24 PAD12.1
CH_TX
  Top 0.61: U3.35 32.55,13.15 PAD13.1
CHARGE_DISABLE  (via drill 0.6 pad 1.3)
  Top 0.61: U3.37 30.47,10.62 27.29,7.44 v27.29,7.62
  Bottom 0.61: v27.29,7.62 24.75,7.62 R13.1
CHARGE_E
  Bottom 0.61: T3.3 18.4,10.33 R14.2 16.14,13.82 IC5.8
CHARGED_LOW  (via drill 0.6 pad 1.3)
  Top 0.61: U3.27 33.19,23.32 32.38,24.13 v32.38,26.04
  Bottom 0.61: IC5.6 12.69,19.05 | 12.69,19.05 12.69,33.66 14.6,35.56 17.77,35.56 19.04,34.29 26.02,34.29 32.38,27.94 v32.38,26.04 32.38,27.3 | R38.2 10.3,19.05 12.69,19.05
CHARGING_LOW  (via drill 0.6 pad 1.3)
  Top 0.61: U3.28 32.55,22.05 29.2,25.4 v28.56,25.4 | v14.15,15.24 v10.79,15.24
  Bottom 0.61: IC5.7 13.96,15.24 | 13.96,15.24 13.96,27.3 18.09,31.43 24.44,31.43 28.56,27.3 v28.56,25.4 | 13.96,15.24 v14.15,15.24 | R39.2 7.61,18.26 7.61,17.14 9.52,15.24 v10.79,15.24
CHP_EN  (via drill 0.6 pad 1.3)
  Top 0.61: T2.3 43,33.02 v44.44,33.02 | R5.1 61.89,11.88 U3.3 54.15,11.88 v53.33,12.7
  Bottom 0.61: v44.44,33.02 49.52,27.94 49.52,19.68 53.33,15.88 v53.33,12.7
DTR
  Top 0.61: T1.2 33.16,34.29 R2.1 34.76,36.04 34.91,36.2 39.36,36.2 40,35.56 PAD11.1
EN_IR1  (via drill 0.6 pad 1.3)
  Top 0.61: U3.26 39.04,24.66 37.78,24.66 37.68,24.77 34.28,24.77 v34.28,25.06 | R9.1 46.98,31.11 45.08,31.11 v44.44,30.48
  Bottom 0.61: v44.44,30.48 42.54,32.38 34.28,32.38 v34.28,25.06
EN_IR2
  Top 0.61: U3.23 43.25,26.93 43.25,28.19 43.72,28.67 50.16,28.67 R7.1
GND  (via drill 0.6 pad 1.3)  (1 unrouted)
  Top 0.61: C7.2 8.71,28.17 13.33,28.17 | IC8.1 13.33,30.46 13.33,28.17 | 23.48,20.32 22.21,20.32 21.9,20 | 21.9,20 21.58,19.68 IC3.3 | 20.94,2.54 20.98,2.58 | 20.98,2.58 20.98,3.17 | 20.98,3.17 20.98,4.71 U$1.5 20.97,2.58 20.98,2.58 | 37.46,2.54 37.46,9.35 U3.38 46.16,9.35 48.89,12.06 48.89,16.57 U3.39 47.62,15.85 | 37.46,2.54 32.38,2.54 | 21.02,2.54 20.98,2.58 | 21.9,20 18.72,20 17.77,20.95 17.77,27.3 v17.13,27.94 16.9,28.17 13.33,28.17 | v3.17,15.24 1.96,14.03 1.96,5.08 PAD2.1 6.98,5.08 7.61,4.45 v10.15,4.45 12.05,2.54 14.08,2.54 14.26,2.36 20.94,2.36 | PAD16.1 v32.38,5.71 32.38,2.54 | 32.38,2.54 27.29,2.54 | 27.29,2.54 25.27,2.54 25.09,2.36 20.94,2.36 | 20.98,3.17 20.94,3.14 20.94,2.36 | 27.29,2.54 v27.29,5.08 25.39,5.08 24.98,5.49 D5.C | C5.1 20.94,26.9 v20.94,29.21 21.58,29.84 PAD5.1 21.58,35.56 19.27,35.56 C1.2 | U3.1 56.12,7.64 57.64,6.12 C4.1 55.47,2.54 | 55.47,2.54 37.46,2.54 | U3.15 v53.33,29.21 53.33,31.11 | 53.33,31.11 53.97,31.75 IC4.4 57.72,29.75 R6.1 59.53,26.19 60.32,25.4 64.76,25.4 65.71,26.35 | 65.71,26.35 66.03,26.67 R12.1 R4.1 73.5,28.42 v76.82,31.75 | 55.47,2.54 56.1,1.91 62.86,1.91 64.76,3.81 v64.76,5.37 | v67.3,25.4 66.66,25.4 65.71,26.35 | R8.1 53.33,31.11
  Bottom 0.61: C3.2 C2.2 20.87,23.01 R10.1 18.4,26.67 | 32.69,9.84 32.38,9.53 v32.38,5.71 32.38,5.56 33.65,4.29 R36.1 | 32.69,9.84 34.28,11.43 IC1.8 32.69,9.94 32.69,9.84 | R33.1 R31.1 R27.1 R28.1 R29.1 R30.1 72.23,4.45 65.39,4.45 64.61,5.23 64.61,5.53 | R34.1 R32.1 R37.1 71.74,30 71.74,31.11 72.28,31.65 76.93,31.65 | IC7.8 78.83,31.65 76.93,31.65 | IC5.3 12.69,5.71 11.42,4.45 v10.15,4.45 9.03,4.45 R15.1 | R3.1 20.77,7.93 T3.2 20.77,7.79 23.48,5.08 v27.29,5.08 | 32.69,9.84 30.79,9.84 23.97,16.66 R26.1 | R24.1 64.61,5.53 | 64.61,5.53 v64.76,5.37 | v67.3,25.4 67.3,21.59 66.66,20.95 IC6.3 | 76.93,31.65 v76.82,31.75 | v53.33,29.21 52.06,29.21 45.71,35.56 44.44,35.56 41.9,38.1 35.55,38.1 33.01,35.56 20.79,35.56 16.74,39.61 | 18.4,26.67 v20.94,29.21 | v17.13,27.94 18.4,26.67 | v3.17,15.24 1.9,16.51 1.9,23.5 1.32,24.07 1.32,29.27 9.52,37.47 9.52,41.91 14.44,41.91 16.74,39.61 | D4.C D3.C 10.79,28.17 10.79,33.66 16.74,39.61
  pour Top: 56.51,1.91 56.51,27.3 38.09,27.3 38.73,8.26 33.65,8.26 33.65,1.91
IO0
  Top 0.61: T1.3 30,31.29 33.99,27.3 37.46,27.3 38.91,25.86 U3.25
IR1_LED_ANODE
  Top 0.61: PAD8.1 57.77,35.62 IC4.1
IR1_LED_CATHODE
  Top 0.61: PAD7.1 55.8,39.3 55.8,34.92 56.44,34.29 IC4.2 59.68,34.29 59.68,31.11 62.22,28.57 62.37,28.57 R6.2
IR2_LED_ANODE
  Top 0.61: IC4.7 66.03,34.29 66.66,34.92 66.66,38.1 66.03,38.73 PAD10.1
IR2_LED_CATHODE
  Top 0.61: PAD9.1 59.68,36.83 60.95,35.56 60.95,33.02 IC4.6 68.57,33.02 R4.2
N$1
  Top 0.61: R40.1 D5.A
N$3
  Bottom 0.61: IC1.6 36.82,10.16 34.91,8.26 R36.2
N$4
  Bottom 0.61: R38.1 D3.A
N$5
  Top 0.61: T1.1 33.16,30.48 R11.2
N$6
  Bottom 0.61: R39.1 D4.A
N$10
  Top 0.61: IC3.2 20.31,15.88 19.44,15.01 C6.1
N$11
  Bottom 0.61: R37.2 75.55,29.84 77.46,27.94 IC7.6
N$13
  Bottom 0.61: R13.2 23.96,11.11 T3.1
N$14
  Bottom 0.61: R17.2 39.36,22.71 IC1.13
N$16
  Top 0.61: IC3.4 22.85,14.38 C6.2
N$18
  Top 0.61: R2.2 38.09,34.29 39.04,33.34 T2.1
N$19
  Bottom 0.61: IC1.14 40.63,19.68 42.54,21.59 R1.2
N$20  (via drill 0.6 pad 1.3)
  Top 0.61: v45.71,11.43 43.17,13.97 43.17,22.23 44.44,23.5 v47.62,23.5
  Bottom 0.61: R21.1 R23.1 R22.1 R20.1 47.46,4.29 47.62,4.45 47.62,9.53 46.98,10.16 | R19.1 R17.1 R1.1 R18.1 47.46,26.19 47.62,26.04 v47.62,23.5 | 46.98,10.16 46.98,10.49 47.92,11.43 49.83,11.43 52.55,8.71 56.51,8.71 57.14,9.35 57.14,14.23 59.08,16.17 61.98,16.17 63.49,14.66 64.76,14.66 65.39,15.29 IC6.2 65.39,29.52 70.95,35.08 70.95,35.41 D2.P$2 | 46.98,10.16 v45.71,11.43
N$29
  Bottom 0.61: IC6.5 67.93,7.62 R24.2 67.68,7.39 68.01,7.32 68.57,6.75 C8.1
N$30  (via drill 0.6 pad 1.3)
  Top 0.61: R9.2 v46.98,36.83 | v53.33,36.83 R8.2 54.37,34.44 55.79,33.02 IC4.3
  Bottom 0.61: v46.98,36.83 v53.33,36.83
N$31  (via drill 0.6 pad 1.3)
  Top 0.61: R12.2 65.55,31.75 63.49,31.75 | 63.49,31.75 IC4.5 | v63.49,30.48 63.49,31.75 | R7.2 50.16,40.64 50.79,41.27 67.3,41.27 68.72,39.85 v68.72,35.08
  Bottom 0.61: v68.72,35.08 64.12,30.48 v63.49,30.48
N$32
  Bottom 0.61: IC1.15 41.9,19.05 42.54,19.68 45.08,19.68 R18.2
N$33
  Bottom 0.61: IC1.12 38.09,22.71 R19.2
N$34
  Bottom 0.61: IC1.1 43.17,11.43 45.08,9.53 R20.2
N$35
  Bottom 0.61: IC1.5 38.09,8.89 37.46,8.26 R21.2
N$36
  Bottom 0.61: IC1.2 41.9,7.77 R22.2
N$37
  Bottom 0.61: IC1.4 39.36,8.89 40,8.26 R23.2
N$39
  Bottom 0.61: IC6.6 66.66,12.65 67.5,13.49 69.03,13.49 70.32,14.78 70.32,15.56 73.21,18.45 R25.2 74.44,22.15 C9.1 75.24,22.23 77.15,24.13 IC7.3
N$40
  Bottom 0.61: IC7.13 83.13,25.4 80.91,23.18 80.91,20.32 79.36,18.77 79.36,10.79 R27.2
N$41
  Bottom 0.61: R28.2 76.71,8.46 79.7,8.46 80.7,9.46 80.7,18.35 82.03,19.68 82.03,22.72 83.44,24.13 IC7.14
N$42
  Bottom 0.61: IC7.15 83.75,22.86 83.15,22.26 83.15,20.92 83.17,20.9 83.17,18.41 81.91,17.14 81.91,8.26 79.36,5.71 R29.2
N$43  (via drill 0.6 pad 1.3)
  Top 0.61: v86.98,15.88 79.36,8.26 v79.36,3.17
  Bottom 0.61: R30.2 v79.36,3.17 | v86.98,15.88 86.98,26.04 86.35,26.67 IC7.12
N$44
  Bottom 0.61: IC7.1 78.09,20.85 78.09,13.34 R31.2
N$45
  Bottom 0.61: IC7.5 76.19,26.67 75.55,27.3 R32.2
N$46
  Bottom 0.61: IC7.2 77.46,22.86 76.82,22.23 76.82,15.88 R33.2
N$47
  Bottom 0.61: R34.2 75.07,25.4 IC7.4
PHOTODIODE_ADC  (via drill 0.6 pad 1.3)
  Top 0.61: v46.98,12.7 46.15,13.53 45.78,13.53 44.44,14.87 44.44,21.59 44.78,21.93 50.45,21.93 52.7,19.68 52.7,17.42 53.15,16.96 U3.7 61.77,16.96 | v70.47,12.06 66.66,12.06 61.77,16.96 | 61.77,16.96 61.59,17.14 v61.59,17.78
  Bottom 0.61: IC1.3 40.63,13.34 41.27,13.97 45.71,13.97 v46.98,12.7 | IC6.1 62.91,17.78 v61.59,17.78 | C8.2 v70.47,12.06
PHOTODIODE_GAIN_A  (via drill 0.6 pad 1.3)
  Top 0.61: v29.2,22.23 30.47,22.23 31.92,20.77 U3.29
  Bottom 0.61: IC1.11 36.82,20.32 36.19,20.95 31.74,20.95 30.47,22.23 v29.2,22.23
PHOTODIODE_GAIN_B  (via drill 0.6 pad 1.3)
  Top 0.61: v29.83,19.81 30.34,19.81 30.79,19.37 37.72,19.37 37.78,19.43 39.04,19.43 U3.30
  Bottom 0.61: IC1.10 35.55,19.05 34.86,19.75 29.9,19.75 v29.83,19.81
PHOTODIODE_GAIN_C  (via drill 0.6 pad 1.3)
  Top 0.61: v28.22,18.25 39.1,18.25 U3.31
  Bottom 0.61: IC1.9 33.71,18.25 v28.22,18.25
PPG_SIGNAL_ADC  (via drill 0.6 pad 1.3)
  Top 0.61: U3.6 59.05,15.7 60.14,14.61 v60.95,14.61 60.1,14.61 59.69,15.01
  Bottom 0.61: C9.2 71.59,22.15 R25.1 69.2,17.3 69.2,15.24 68.57,14.61 66.66,14.61 65.39,13.34 64.76,13.34 | 64.76,13.34 60.95,13.34 v60.95,14.61 | 64.76,13.34 65.39,12.7 IC6.7
PPG_SIGNAL_GAIN_A  (via drill 0.6 pad 1.3)
  Top 0.61: U3.16 v52.06,23.5
  Bottom 0.61: v52.06,23.5 53.97,23.5 54.6,24.13 54.6,28.27 57.3,30.97 57.3,35.71 62.56,40.97 69.2,40.97 69.83,40.35 77.46,40.35 86.06,31.75 86.98,31.75 86.98,27.94 IC7.11
PPG_SIGNAL_GAIN_B  (via drill 0.6 pad 1.3)
  Top 0.61: U3.10 57.93,20.77 v58.89,21.74
  Bottom 0.61: v58.89,21.74 60.32,23.16 60.32,35.56 63.49,38.73 67.3,38.73 67.93,38.1 76.19,38.1 82.54,31.75 82.54,29.21 IC7.10
PPG_SIGNAL_GAIN_C  (via drill 0.6 pad 1.3)
  Top 0.61: U3.13 57.07,24.59 57.09,24.61 58,24.61 v58.45,25.06
  Bottom 0.61: v58.45,25.06 58.45,32.98 58.42,33.01 58.42,35.24 63.03,39.85 68.09,39.85 68.71,39.23 76.96,39.23 85.08,31.11 85.08,30.58 IC7.9
R_PROG
  Bottom 0.61: IC5.2 13.96,4.93 R3.2
RTS
  Top 0.61: R11.1 38.56,31.43 T2.2 40,31.27 40,29.21 PAD15.1
SCL
  Top 0.61: PAD3.1 25.39,15.88 29.38,11.88 U3.36
SDA
  Top 0.61: U3.33 36.37,15.7 35.37,16.69 27.12,16.69 26.66,17.14 26.66,29.84 27.93,31.11 PAD4.1
T7
  Top 0.61: U3.12 56.19,23.39 57.45,23.39 57.55,23.5 PAD17.1
T8
  Top 0.61: PAD18.1 61.28,19.68 59.83,18.23 U3.8
T9
  Top 0.61: PAD14.1 60.95,21.59 58.87,19.5 U3.9
V_BATT  (via drill 0.6 pad 1.3)
  Top 0.61: v6.98,15.24 5.71,15.24
  Top 0.813: PAD1.1 5.71,15.24 5.71,20.28 Q5.3
  Bottom 0.61: R16.2 8.25,12.55 8.25,12.7 | 8.25,12.7 v6.98,15.24 | IC5.5 8.46,12.91 8.25,12.7
V_BATT_ADC  (via drill 0.6 pad 1.3)
  Top 0.61: v59.05,13.45 58.75,13.15 U3.4
  Bottom 0.61: R16.1 4.28,7.62 | 4.28,7.62 R15.2 | 4.28,7.62 5.51,6.39 5.51,5.11 9.3,1.32 54.65,1.32 55.23,1.91 55.23,5.08 59.05,8.89 v59.05,13.45
V_USB  (via drill 0.6 pad 1.3)
  Top 0.406: U$1.1 18.37,6.61
  Top 0.61: U$1.1 18.38,6.99 17.13,6.99 16.98,7.14 16.98,8.26 | 15.22,18.04 D1.A 15.87,18.41 | 15.22,18.04 Q5.1 | 15.87,18.41 v15.87,16.51 17.13,15.24 17.13,13.34 16.98,13.18 R40.2 16.98,8.26 | 15.22,18.04 15.49,18.04 15.87,18.41 | 16.98,8.26 16.35,8.89 v9.52,8.89
  Bottom 0.61: R14.1 R35.2 | R14.1 R10.2 20.87,20.17 C2.1 C3.1 | v15.87,16.51 16.02,16.66 R14.1 | IC5.4 9.94,8.89 v9.52,8.89
V_USB_ADC  (via drill 0.6 pad 1.3)
  Top 0.61: U3.5 52.34,14.43 50.79,12.87 50.79,10.79 v49.52,9.53
  Bottom 0.61: v49.52,9.53 49.52,3.81 48.15,2.44 31.53,2.44 29.83,4.13 29.83,8.89 24.91,13.82 R26.2 R35.1
VIN
  Top 0.61: IC8.2 13.94,36.2 C1.1 15.63,37.23 17.13,38.73 PAD20.1
VIN_SW  (via drill 0.6 pad 1.3)
  Top 0.61: 12.95,22.6 Q5.2 14.6,22.6 | PAD19.1 12.69,40.01 v12.05,40.01 | D1.C 15.22,22.6 14.6,22.6 | 14.6,22.6 14.6,24.77 3.8,24.77 v3.17,25.4
  Bottom 0.61: v12.05,40.01 12.05,37.47 3.17,28.57 v3.17,25.4